# Altium schematic sheet Misc.SchDoc: Shepherd - Misc
size 381 x 241 mm; Author: Ingmar; CompanyName: NES Lab / TU Dresden; DocumentNumber: 8; SheetNumber: 8; SheetTotal: 8
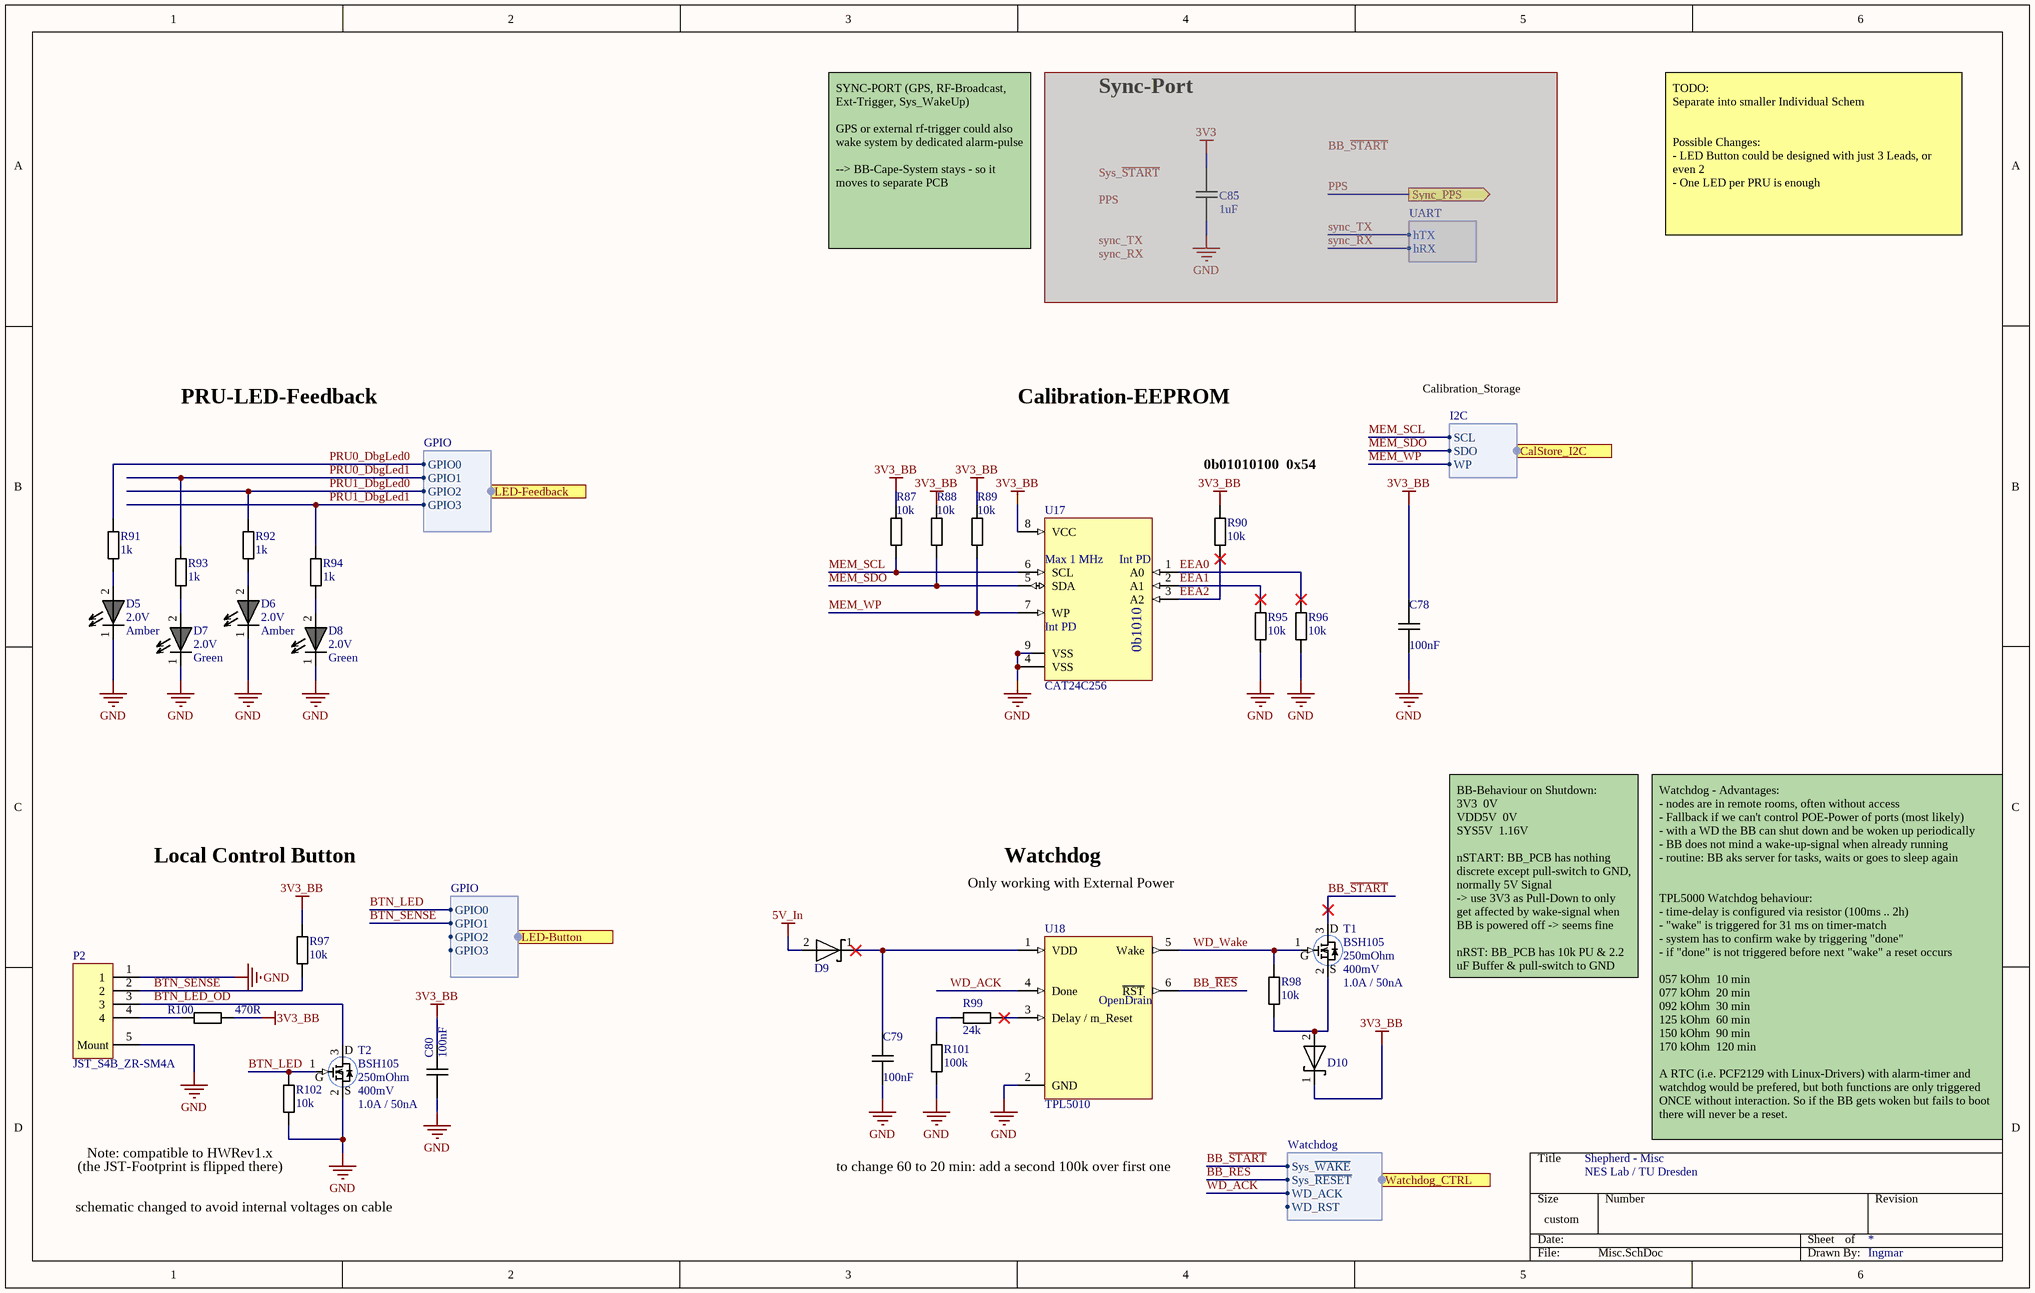
[diagram p0: Misc.SchDoc]

## Parts
C78  value 100nF  [CAPC1005X06]  (hidden comment: C_0402_100nF_16V)
C79  value 100nF  [CAPC1005X06]  (hidden comment: C_0402_100nF_16V)
C80  value 100nF  [CAPC1005X06]  (hidden comment: C_0402_100nF_16V)
C85  value 1uF  [CAPC1608X09]  (hidden comment: .C_0603_1uF_10V)  (masked out: inside a compile mask, not in the netlist)
D5  value Amber  V_max: 2.0V  [DIOM1608X02N Orange]  (hidden comment: D_LED_0603_Amber)
D6  value Amber  V_max: 2.0V  [DIOM1608X02N Orange]  (hidden comment: D_LED_0603_Amber)
D7  value Green  V_max: 2.0V  [DIOM1608X02N Green]  (hidden comment: D_LED_0603_Green)
D8  value Green  V_max: 2.0V  [DIOM1608X02N Green]  (hidden comment: D_LED_0603_Green)
D9  D_SOD523_370mV_500mA  [SODFL160X70-2N]  (value not drawn)
D10  D_SOD523_370mV_500mA  [SODFL160X70-2N]  (value not drawn)
P2  JST_S4B_ZR-SM4A  [P_JST_S4B-ZR-SM4A]
R87  value 10k  [RESC1005X04]  (hidden comment: R_0402_10k)
R88  value 10k  [RESC1005X04]  (hidden comment: R_0402_10k)
R89  value 10k  [RESC1005X04]  (hidden comment: R_0402_10k)
R90  value 10k  [RESC1005X04]  (hidden comment: R_0402_10k)
R91  value 1k  [RESC1005X04]  (hidden comment: R_0402_1k)
R92  value 1k  [RESC1005X04]  (hidden comment: R_0402_1k)
R93  value 1k  [RESC1005X04]  (hidden comment: R_0402_1k)
R94  value 1k  [RESC1005X04]  (hidden comment: R_0402_1k)
R95  value 10k  [RESC1005X04]  (hidden comment: R_0402_10k)
R96  value 10k  [RESC1005X04]  (hidden comment: R_0402_10k)
R97  value 10k  [RESC1005X04]  (hidden comment: R_0402_10k)
R98  value 10k  [RESC1005X04]  (hidden comment: R_0402_10k)
R99  value 24k  [RESC1005X04]  (hidden comment: R_0402_24k)
R100  value 470R  [RESC1005X04]  (hidden comment: R_0402_470R)
R101  value 100k  [RESC1005X04]  (hidden comment: R_0402_100k_1%)
R102  value 10k  [RESC1005X04]  (hidden comment: R_0402_10k)
T1  BSH105  R_min: 250mOhm  V_min: 400mV  I_max: 1.0A / 50nA  [SOT95P230X110-3N]
T2  BSH105  R_min: 250mOhm  V_min: 400mV  I_max: 1.0A / 50nA  [SOT95P230X110-3N]
U17  CAT24C256  [PSON50P300X55_HS-9N]
U18  TPL5010  [SOT95P280X100-6N]

## Ports
CalStore_I2C (in, harness I2C), LED-Button (in, harness GPIO), LED-Feedback (in, harness GPIO), Sync_PPS (out), Watchdog_CTRL (in, harness Watchdog)

## Harnesses
UART: hTX, hRX
I2C: SCL, SDO, WP
GPIO: GPIO0, GPIO1, GPIO2, GPIO3
Watchdog: Sys_~{WAKE}, Sys_~{RESET}, WD_ACK, WD_RST

## Nets
3V3_BB: C78.2 C80.2 D10.1 R87.2 R88.2 R89.2 R90.2 R97.2 R100.1 U17.8(VCC)
5V_In: D9.2
GND: C78.1 C79.1 C80.1 D5.1 D6.1 D7.1 D8.1 P2.1 P2.5(Mount) R95.1 R96.1 R101.1 R102.1 T2.2(S) U17.4(VSS) U17.9(VSS) U18.2(GND)
BB_~{RES}: U18.6(~{RST}) ; port Watchdog_CTRL.Sys_~{RESET}
BB_~{START}: T1.3(D) ; port Watchdog_CTRL.Sys_~{WAKE}
BTN_LED: R102.2 T2.1(G) ; port LED-Button.GPIO0
BTN_LED_OD: P2.3 T2.3(D)
BTN_SENSE: P2.2 R97.1 ; port LED-Button.GPIO1
EEA0: R96.2 U17.1(A0)
EEA1: R95.2 U17.2(A1)
EEA2: R90.1 U17.3(A2)
MEM_SCL: R87.1 U17.6(SCL) ; port CalStore_I2C.SCL
MEM_SDO: R88.1 U17.5(SDA) ; port CalStore_I2C.SDO
MEM_WP: R89.1 U17.7(WP) ; port CalStore_I2C.WP
PRU0_DbgLed0: R91.2 ; port LED-Feedback.GPIO0
PRU0_DbgLed1: R93.2 ; port LED-Feedback.GPIO1
PRU1_DbgLed0: R92.2 ; port LED-Feedback.GPIO2
PRU1_DbgLed1: R94.2 ; port LED-Feedback.GPIO3
WD_ACK: U18.4(Done) ; port Watchdog_CTRL.WD_ACK
WD_Wake: R98.2 T1.1(G) U18.5(Wake)
NetC79_2: C79.2 D9.1 U18.1(VDD)
NetD5_2: D5.2 R91.1
NetD6_2: D6.2 R92.1
NetD7_2: D7.2 R93.1
NetD8_2: D8.2 R94.1
NetD10_2: D10.2 R98.1 T1.2(S)
NetP2_4: P2.4 R100.2
NetR99_1: R99.1 U18.3(Delay_/_m_Reset)
NetR99_2: R99.2 R101.2

## Notes on the sheet
- Sync-Port
- TODO:
  Separate into smaller Individual Schem
  Possible Changes:
  - LED Button could be designed with just 3 Leads, or even 2
  - One LED per PRU is enough
- SYNC-PORT (GPS, RF-Broadcast, Ext-Trigger, Sys_WakeUp)
  GPS or external rf-trigger could also wake system by dedicated alarm-pulse
  --> BB-Cape-System stays - so it moves to separate PCB
- PRU-LED-Feedback
- Calibration-EEPROM
- Calibration_Storage
- (near R90) 0b01010100  0x54
- Local Control Button
- Watchdog
- Only working with External Power
- BB-Behaviour on Shutdown:
  3V3		0V
  VDD5V		0V
  SYS5V		1.16V
  nSTART: BB_PCB has nothing discrete except pull-switch to GND, normally 5V Signal
  -> use 3V3 as Pull-Down to only get affected by wake-signal when BB is powered off -> seems fine
  nRST: BB_PCB has 10k PU & 2.2 uF Buffer & pull-switch to GND
- (near R102) Note: compatible to HWRev1.x
- (near R102) (the JST-Footprint is flipped there)
- to change 60 to 20 min: add a second 100k over first one
- Watchdog - Advantages:
  - nodes are in remote rooms, often without access
  - Fallback if we can't control POE-Power of ports (most likely)
  - with a WD the BB can shut down and be woken up periodically
  - BB does not mind a wake-up-signal when already running
  - routine: BB aks server for tasks, waits or goes to sleep again
  TPL5000 Watchdog behaviour:
  - time-delay is configured via resistor (100ms .. 2h)
  - "wake" is triggered for 31 ms on timer-match
  - system has to confirm wake by triggering "done"
  - if "done" is not triggered before next "wake" a reset occurs
  057 kOhm		10 min
  077 kOhm		20 min
  092 kOhm		30 min
  125 kOhm		60 min
  150 kOhm		90 min
  170 kOhm		120 min
  A RTC (i.e. PCF2129 with Linux-Drivers) with alarm-timer and watchdog would be prefered, but both functions are only triggered ONCE without interaction. So if the BB gets woken but fails to boot there will never be a reset.
- schematic changed to avoid internal voltages on cable
- (in symbol CAT24C256-HU4) Max 1 MHz; Int PD; 0b1010
- (in symbol TPL5010) OpenDrain

## Library data of the parts
C78-C80 = .C_0402_100nF_16V: Capacitor; Manufacturer: Taiyo Yuden; Manufacturer PN: EMF105B7104MVHF; V_max: 16V; Tolerance: 20%; Dielectric: X7R; Distributer: Mouser; Distributer PN: 963-EMF105B7104MVHF; Price n10 [€]: 0.03
C85 = .C_0603_1uF_10V: Capacitor; Manufacturer: KEMET; Manufacturer PN: C0603C105K8RACTU; V_max: 10V; Tolerance: 10%; Dielectric: X7R; Distributer: Mouser; Distributer PN: 80-C0603C105K8R; Price n10 [€]: 0.03
D5 D6 = .D_LED_0603_Amber: LED Amber 610nm, 0603, 130 mcd, 2V@20mA; Manufacturer: Wuerth; Manufacturer PN: 150060AS75000; I_max: 20mA; I_typ: 5mA; V_typ: 1.9V; Distributer: Mouser; Distributer PN: 710-150060AS75000; Price n10 [€]: 0.12
D7 D8 = .D_LED_0603_Green: LED YellowGreen 575nm, 0603, 60mcd 2V@20mA; Manufacturer: Wuerth; Manufacturer PN: 150060VS55040; I_max: 20mA; I_typ: 5mA; V_typ: 1.85V; Distributer: Mouser; Distributer PN: 710-150060VS55040; Price n10 [€]: 0.14
D9 D10 = .D_SOD523_370mV_500mA: Diode Si, 370mV 500mA forward, 30V 52uA reverse, 3 A Surge,; Manufacturer: On Semi; Manufacturer PN: NSR05T30XV2T5G; P_max: 350mW; Value: 370mV / 30V; I_max: 500mA / 52uA; Distributer: Mouser; Distributer PN: 863-NSR05T30XV2T5G; Price n10 [€]: 0.18
P2 = .P_JST_S4B_ZR-SM4A: CONN HEADER SMD R/A 4POS 1.5MM; Manufacturer: JST; Manufacturer PN: S4B-ZR-SM4A-TF(LF)(SN); I_max: 1A; V_max: 50V; Distributer: Digikey; Distributer PN: 455-1695-1-ND; Price n10 [€]: 0.51
R87-R90 R95-R98 R102 = .R_0402_10k: Resistor; Manufacturer: Panasonic; Manufacturer PN: ERJ-2GEJ103X; P_max: 100mW; V_max: 50V; Tolerance: 5%; Distributer: Mouser; Distributer PN: 667-ERJ-2GEJ103X; Price n10 [€]: 0.02
R91-R94 = .R_0402_1k: Resistor; Manufacturer: Panasonic; Manufacturer PN: ERJ-2GEJ102X; P_max: 100mW; V_max: 50V; Tolerance: 5%; Distributer: Mouser; Distributer PN: 667-ERJ-2GEJ102X; Price n10 [€]: 0.02
R99 = .R_0402_24k: Resistor; Manufacturer: Panasonic; Manufacturer PN: ERJ-2GEJ243X; P_max: 100mW; V_max: 50V; Tolerance: 5%; Distributer: Mouser; Distributer PN: 667-ERJ-2GEJ243X; Price n10 [€]: 0.02
R100 = .R_0402_470R: Resistor; Manufacturer: Panasonic; Manufacturer PN: ERJ-2GEJ471X; P_max: 100mW; V_max: 50V; Tolerance: 5%; Distributer: Mouser; Distributer PN: 667-ERJ-2GEJ471X; Price n10 [€]: 0.02
R101 = .R_0402_100k: Resistor; Manufacturer: Panasonic; Manufacturer PN: ERJ-2RKF1003X; P_max: 100mW; V_max: 50V; Tolerance: 1%; Distributer: Mouser; Distributer PN: 667-ERJ-2RKF1003X; Price n10 [€]: 0.02
T1 T2 = .T_BSH105: Transistor, nMosfet, 20 V Vds, 250 mOhm Rds, +-8V Vgs, 20 ns Fall, 4.5 ns Rise, 3.9 nC Qg, 50 nA Drain Leakage (Vds=16, Vgs=0); Manufacturer: Nexperia; Manufacturer PN: BSH105,215; V_max: 20V; P_max: 410mW; Distributer: Mouser; Distributer PN: 771-BSH105215; Price n10 [€]: 0.21
U17 = CAT24C256-HU4: EEPROM 256-Kb I2C, 1 MHz max; Manufacturer: ON Semi; Manufacturer PN: CAT24C256HU4IGT3; I_max: 1mA; V_max: 5.5V; V_min: 1.8V; Distributer: Mouser; Distributer PN: 863-CAT24C256HU4IGT3; Price n10 [€]: 0.36
U18 = TPL5010: Watchdog Timer, 100ms to 2h, 320 ms Reset Pulse, 20 ms Wake Pulse; Manufacturer: TI; Manufacturer PN: TPL5010DDCR; I_max: 35nA; V_max: 5.5V; V_min: 1.8V; Distributer: Mouser; Distributer PN: 595-TPL5010DDCR; Price n10 [€]: 0.62